# Altium schematic sheet SCH.SchDoc
size A4; SheetNumber: 1; SheetTotal: 1
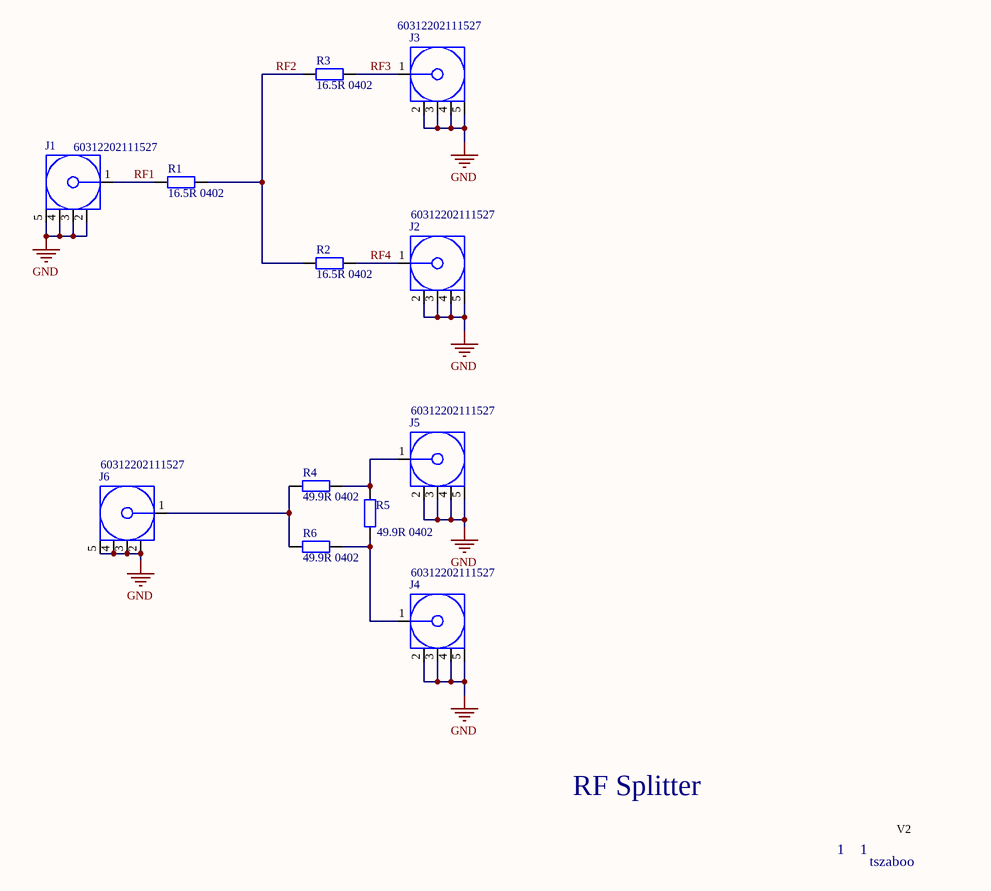
[diagram p0: SCH.SchDoc]

## Parts
J1  60312202111527  [60312202111527]
J2  60312202111527  [60312202111527]
J3  60312202111527  [60312202111527]
J4  60312202111527  [60312202111527]
J5  60312202111527  [60312202111527]
J6  60312202111527  [60312202111527]
R1  SCH: 16.5R 0402  [RESC0402N]  (hidden comment: Res)
R2  SCH: 16.5R 0402  [RESC0402N]  (hidden comment: Res)
R3  SCH: 16.5R 0402  [RESC0402N]  (hidden comment: Res)
R4  SCH: 49.9R 0402  [RESC0402N]  (hidden comment: Res)
R5  SCH: 49.9R 0402  [RESC0402N]  (hidden comment: Res)
R6  SCH: 49.9R 0402  [RESC0402N]  (hidden comment: Res)

## Nets
GND: J1.2(GND) J1.3(GND) J1.4(GND) J1.5(GND) J2.2(GND) J2.3(GND) J2.4(GND) J2.5(GND) J3.2(GND) J3.3(GND) J3.4(GND) J3.5(GND) J4.2(GND) J4.3(GND) J4.4(GND) J4.5(GND) J5.2(GND) J5.3(GND) J5.4(GND) J5.5(GND) J6.2(GND) J6.3(GND) J6.4(GND) J6.5(GND)
RF1: J1.1(Signal) R1.1
RF2: R1.2 R2.1 R3.1
RF3: J3.1(Signal) R3.2
RF4: J2.1(Signal) R2.2
NetJ4_1: J4.1(Signal) R5.1 R6.2
NetJ5_1: J5.1(Signal) R4.2 R5.2
NetJ6_1: J6.1(Signal) R4.1 R6.1

## Notes on the sheet
- RF Splitter
- 1
- V2
- tszaboo

## Library data of the parts
J1-J6 = CMP-03913-134708250-1: 60312202111527 WR-SMA_SMA PCB End Launch Jack; Insulation Resistance: 5GΩ; Connector Type: SMA; Insertion Loss (dB): 0.14dB; Impedance: 50Ω; NexarPartId: 134708250; Min Operating Temperature: -65°C; Insulation Material: PTFE; RoHS: Compliant; Max Operating Temperature: 165°C
R1-R3 = CRCW040216R5FKED: RES SMD 16.5 OHM 1% 1/16W 100PPM 0402; Manufacturer: VISHAY; COMPATIBLES: F1; VALUE: 16.5R; NoPins: 2; Manufacturer P/N: CRCW040216R5FKED; Supplier 1: Digi-Key; Supplier Part Number 1: 541-16.5LCT-ND; SMD: True
R4-R6 = CRCW040249R9FKED: RES SMD 49.9 OHM 1% 1/16W 100PPM 0402; Manufacturer: VISHAY; COMPATIBLES: F1; VALUE: 49.9R; NoPins: 2; Manufacturer P/N: CRCW040249R9FKED; Supplier 1: Digi-Key; Supplier Part Number 1: 541-49.9LCT-ND; SMD: True